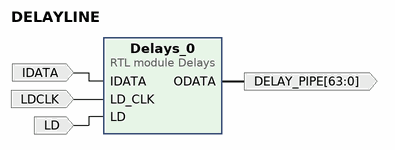
[diagram p0: block diagram of the top level]
# Vivado block design DELAYLINE, xc7z020clg400-1, Vivado 2019.1
create_bd_design DELAYLINE

create_bd_port -dir I IDATA
create_bd_port -dir I LDCLK
create_bd_port -dir I LD
create_bd_port -dir O -from 63 -to 0 DELAY_PIPE

create_bd_cell -type module -reference Delays Delays_0

# ---- connections ----

connect_bd_net [get_bd_ports IDATA] [get_bd_pins Delays_0/IDATA]
connect_bd_net [get_bd_ports LDCLK] [get_bd_pins Delays_0/LD_CLK]
connect_bd_net [get_bd_ports LD] [get_bd_pins Delays_0/LD]
connect_bd_net [get_bd_pins Delays_0/ODATA] [get_bd_ports DELAY_PIPE]

validate_bd_design
save_bd_design
